# EAGLE design citizen-scientist-attachment-1 (EAGLE 9.6.2)
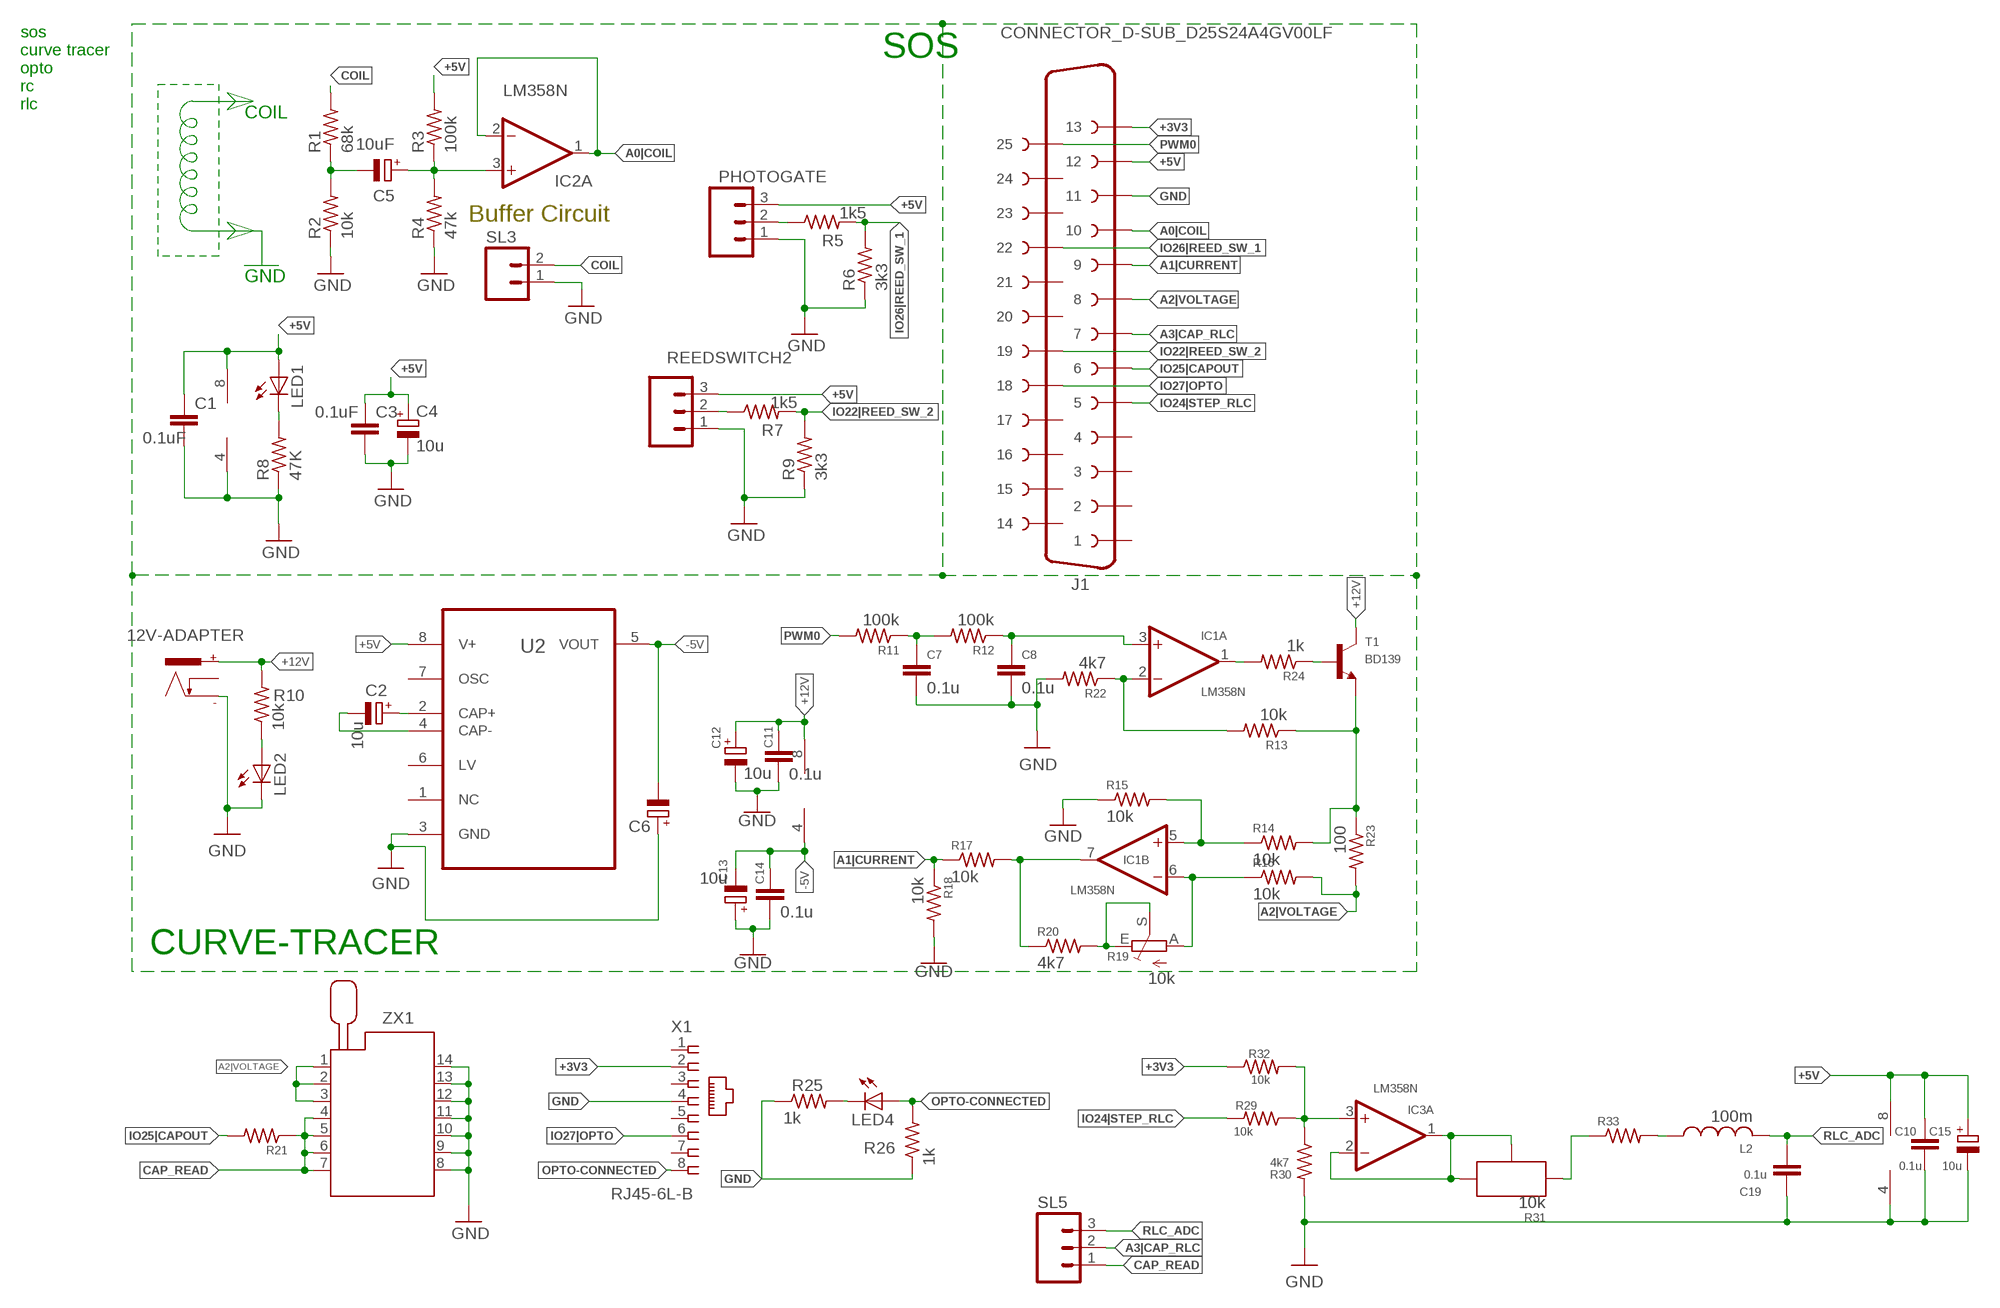
[diagram p0: schematic, sheet 1]

## Parts
12V-ADAPTER  POWER_CON  [NEB21R]
C1  0.1uF  C-EU025-025X050  [C025-025X050]
C2  10u  CPOL-EUTT2D5  [TT2D5]
C3  0.1uF  C-EU025-025X050  [C025-025X050]
C4  10u  CPOL-EUE2.5-6  [E2,5-6]
C5  10uF  CPOL-EUE2.5-6  [E2,5-6]
C6  CPOL-EUTT2D5  [TT2D5]
C7  0.1u  C-EU025-025X050  [C025-025X050]
C8  0.1u  C-EU025-025X050  [C025-025X050]
C10  0.1u  C-EU025-025X050  [C025-025X050]
C11  0.1u  C-EU025-025X050  [C025-025X050]
C12  10u  CPOL-EUTT2D5  [TT2D5]
C13  10u  CPOL-EUTT2D5  [TT2D5]
C14  0.1u  C-EU025-025X050  [C025-025X050]
C15  10u  CPOL-EUTT2D5  [TT2D5]
C19  0.1u  C-EU025-025X050  [C025-025X050]
IC1  LM358N  [DIL08]
IC2  LM358N  [DIL08]
IC3  LM358N  [DIL08]
J1  CONNECTOR_D-SUB_D25S24A4GV00LF  [CONNECTOR_D-SUB_D25S24A4GV00LF]
L2  100m  L-US6000-XXX-RC  [6000-XXXX-RC]
LED1  LED3MM  [LED3MM]
LED2  LED3MM  [LED3MM]
LED4  LED3MM  [LED3MM]
PHOTOGATE  M03  [03P]
R1  68k  R-US_0204/7  [0204/7]
R2  10k  R-US_0204/7  [0204/7]
R3  100k  R-US_0204/7  [0204/7]
R4  47k  R-US_0204/7  [0204/7]
R5  1k5  R-US_0204/7  [0204/7]
R6  3k3  R-US_0204/7  [0204/7]
R7  1k5  R-US_0204/7  [0204/7]
R8  47K  R-US_0204/7  [0204/7]
R9  3k3  R-US_0204/7  [0204/7]
R10  10k  R-US_0204/7  [0204/7]
R11  100k  R-US_0204/7  [0204/7]
R12  100k  R-US_0204/7  [0204/7]
R13  10k  R-US_0207/10  [0207/10]
R14  10k  R-US_0207/10  [0207/10]
R15  10k  R-US_0207/10  [0207/10]
R16  10k  R-US_0207/10  [0207/10]
R17  10k  R-US_0207/10  [0207/10]
R18  10k  R-US_0207/10  [0207/10]
R19  10k  TRIM_EU-RJ9W  [RJ9W]
R20  4k7  R-US_0204/7  [0204/7]
R21  R-US_0204/7  [0204/7]
R22  4k7  R-US_0207/10  [0207/10]
R23  100  R-US_0207/10  [0207/10]
R24  1k  R-US_0204/7  [0204/7]
R25  1k  R-US_0204/7  [0204/7]
R26  1k  R-US_0204/7  [0204/7]
R29  10k  R-US_0204/7  [0204/7]
R30  4k7  R-US_0207/10  [0207/10]
R31  10k  POTNORMAL  [RJ9W]
R32  10k  R-US_0207/10  [0207/10]
R33  R-US_0204/7  [0204/7]
REEDSWITCH2  M03  [03P]
SL3  M02  [02P]
SL5  M03  [03P]
T1  BD139  [TO126]
U2  ICL7660CPAZ_ICL7660CPAZ  [ICL7660CPAZ_DIP254P762X533-8]
X1  RJ45-6L-B  [RJ45-NO-SHIELD]
ZX1  214-3339-00-0602J  [214-3339-00-0602J]

## Nets
+3V3: J1.P$13 R32.1 X1.2
+5V: C1.1 C3.1 C4.+ C10.1 C15.+ IC2.8(P:V+) IC3.8(P:V+) J1.P$14 LED1.A PHOTOGATE.3 R3.2 REEDSWITCH2.3 U2.8(V+)
+12V: 12V-ADAPTER.+ C11.1 C12.+ IC1.8(P:V+) R10.2 T1.2(C)
-5V: C6.- C13.- C14.1 IC1.4(P:V-) U2.5(VOUT)
A0|COIL: IC2.1(A:OUT) IC2.2(A:-IN) J1.P$16
A1|CURRENT: J1.P$17 R17.1 R18.1
A2|VOLTAGE: J1.P$18 R16.2 R23.2 ZX1.1 ZX1.2 ZX1.3
A3|CAP_RLC: J1.P$19 SL5.2
CAP_READ: R21.1 SL5.1 ZX1.4 ZX1.5 ZX1.6 ZX1.7
CLAMP_SIGNAL: C5.+ IC2.3(A:+IN) R3.1 R4.2
COIL: R1.2 SL3.2
GND: 12V-ADAPTER.- C1.2 C3.2 C4.- C6.+ C7.2 C8.2 C10.2 C11.2 C12.- C13.+ C14.2 C15.- C19.2 IC2.4(P:V-) IC3.4(P:V-) J1.P$15 LED2.K(C) PHOTOGATE.1 R2.1 R4.1 R6.1 R8.1 R9.1 R15.1 R18.2 R22.2 R25.1 R26.1 R30.2 REEDSWITCH2.1 SL3.1 U2.3(GND) X1.4 ZX1.8 ZX1.9 ZX1.10 ZX1.11 ZX1.12 ZX1.13 ZX1.14
IO22|REED_SW_2: J1.P$7 R7.2 R9.2
IO24|STEP_RLC: J1.P$21 R29.2
IO25|CAPOUT: J1.P$20 R21.2
IO26|REED_SW_1: J1.P$4 R5.2 R6.2
IO27|OPTO: J1.P$8 X1.6
N$1: C5.- R1.1 R2.2
N$2: PHOTOGATE.2 R5.1
N$3: R7.1 REEDSWITCH2.2
N$5: LED1.K(C) R8.2
N$9: C2.+ U2.2(CAP+)
N$10: C2.- U2.4(CAP-)
N$11: C7.1 R11.1 R12.2
N$12: LED2.A R10.1
N$13: IC1.1(A:OUT) R24.2
N$14: R24.1 T1.3(B)
N$15: C8.1 IC1.3(A:+IN) R12.1
N$16: IC1.2(A:-IN) R13.2 R22.1
N$17: IC1.5(B:+IN) R14.1 R15.2
N$18: IC1.6(B:-IN) R16.1 R19.A
N$19: R13.1 R14.2 R23.1 T1.1(E)
N$20: R19.E R19.S R20.2
N$21: IC1.7(B:OUT) R17.2 R20.1
N$22: LED4.K(C) R25.2
N$26: IC3.3(A:+IN) R29.1 R30.1 R32.2
N$27: IC3.1(A:OUT) IC3.2(A:-IN) R31.A R31.S
N$28: R31.E R33.1
N$29: L2.1 R33.2
OPTO-CONNECTED: LED4.A R26.2 X1.8
PWM0: J1.P$1 R11.2
PWM1: J1.P$6
RLC_ADC: C19.1 L2.2 SL5.3
Unconnected: 12V-ADAPTER.C IC2.5(B:+IN) IC2.6(B:-IN) IC2.7(B:OUT) IC3.5(B:+IN) IC3.6(B:-IN) IC3.7(B:OUT) J1.1 J1.P$2 J1.P$3 J1.P$5 J1.P$9 J1.P$10 J1.P$11 J1.P$12 J1.P$22 J1.P$23 J1.P$24 U2.1(NC) U2.6(LV) U2.7(OSC) X1.1 X1.3 X1.5 X1.7

## Notes on the sheet
- SOS
- sos
  curve tracer
  opto
  rc
  rlc
- COIL
- Buffer Circuit
- GND
- CURVE-TRACER

## Library data of the parts
12V-ADAPTER = CEDT_JANUARY_2015_v5:POWER_CON: DC Power Connector
C1 C3 = Arduino_Hackathon_v5:C-EU: CAPACITOR, European symbol
C2 C4-C6 C12 C13 C15 = rcl:CPOL-EU: POLARIZED CAPACITOR, European symbol; SPICEPREFIX: C
C7 C8 C10 C11 C14 C19 = rcl:C-EU: CAPACITOR, European symbol; SPICEPREFIX: C
IC1-IC3 = CEDT_JANUARY_2015_v5:LM358: OP AMP also LM158; LM258; LM2904 Source: http://cache.national.com/ds/LM/LM158.pdf
J1 = d25-female:CONNECTOR_D-SUB_D25S24A4GV00LF: D-SUB, 25POS, RCPT, VERT SLDR Datasheet <https://cdn.amphenol-icc.com/media/wysiwyg/files/documentation/datasheet/inputoutput/io_dsub_d8656.pdf> Drawing <https://cdn.amphenol-icc.com/media/wysiwyg/files/drawing/c01-8646-0815.pdf>; CATEGORY: Connector; DESCRIPTION: 25 Position D-Sub Receptacle, Female Sockets Connector; GENDER: Female; MANUFACTURER: amphenol-icc; MPN: D25S24A4GV00LF; OPERATING_TEMP: -55°C to +125°C; PART_STATUS: Active; ROHS_COMPLIANT: EU RoHS With Exemption 6c; SERIES: DELTA D; SUB-CATEGORY: D-SUB; TYPE: Vertical
L2 = rcl:L-US: INDUCTOR, American symbol; SPICEPREFIX: L
LED1 LED2 LED4 = CEDT_JANUARY_2015_v5:LED
PHOTOGATE REEDSWITCH2 SL5 = con-amp-quick:M03: AMP QUICK CONNECTOR; OC_FARNELL: unknown; OC_NEWARK: unknown
R1-R18 R20-R26 R29 R30 R32 R33 = rcl:R-US_: RESISTOR, American symbol; SPICEPREFIX: R
R19 = pot:TRIM_EU-: POTENTIOMETER
R31 = CEDT_JANUARY_2015_v5:POT
SL3 = con-amp-quick:M02: AMP QUICK CONNECTOR; OC_FARNELL: unknown; OC_NEWARK: unknown
T1 = transistor:BD139: NPN TRANSISTOR
U2 = CurveTracer_V6:ICL7660CPAZ_ICL7660CPAZ: CMOS Voltage Converters Check prices <https://pricing.snapeda.com/parts/ICL7660CPAZ/Renesas%20Electronics/view-part?ref=eda>; AVAILABILITY: In Stock; DESCRIPTION: Charge Pump Switching Regulator IC Positive or Negative Fixed -Vin, 2Vin 1 Output 45mA 8-DIP (0.300, 7.62mm); MF: Renesas Electronics; MP: ICL7660CPAZ; PACKAGE: DIP-8 Intersil; PRICE: None
X1 = con-tycoelectronics:RJ45: CORCOM Modular RJ Jacks No Shield Source: www.tycoelectronics.com .. ENG_DS_1654001_1099_RJ_L_0507.pdf; MPN: RJ45-6L-B; OC_FARNELL: unknown; OC_NEWARK: 16R6090
ZX1 = con-3m:214-3339-00-0602J: Zero Insertion Force Socked Source: http://www.3M.com/ehpd; MF: 3M; MPN: 214-3339-00-0602J; OC_FARNELL: 1247151; OC_NEWARK: 85K7793

## Net classes
0 default: width 0.813 mm
1 POWER: width 1.016 mm

## Board
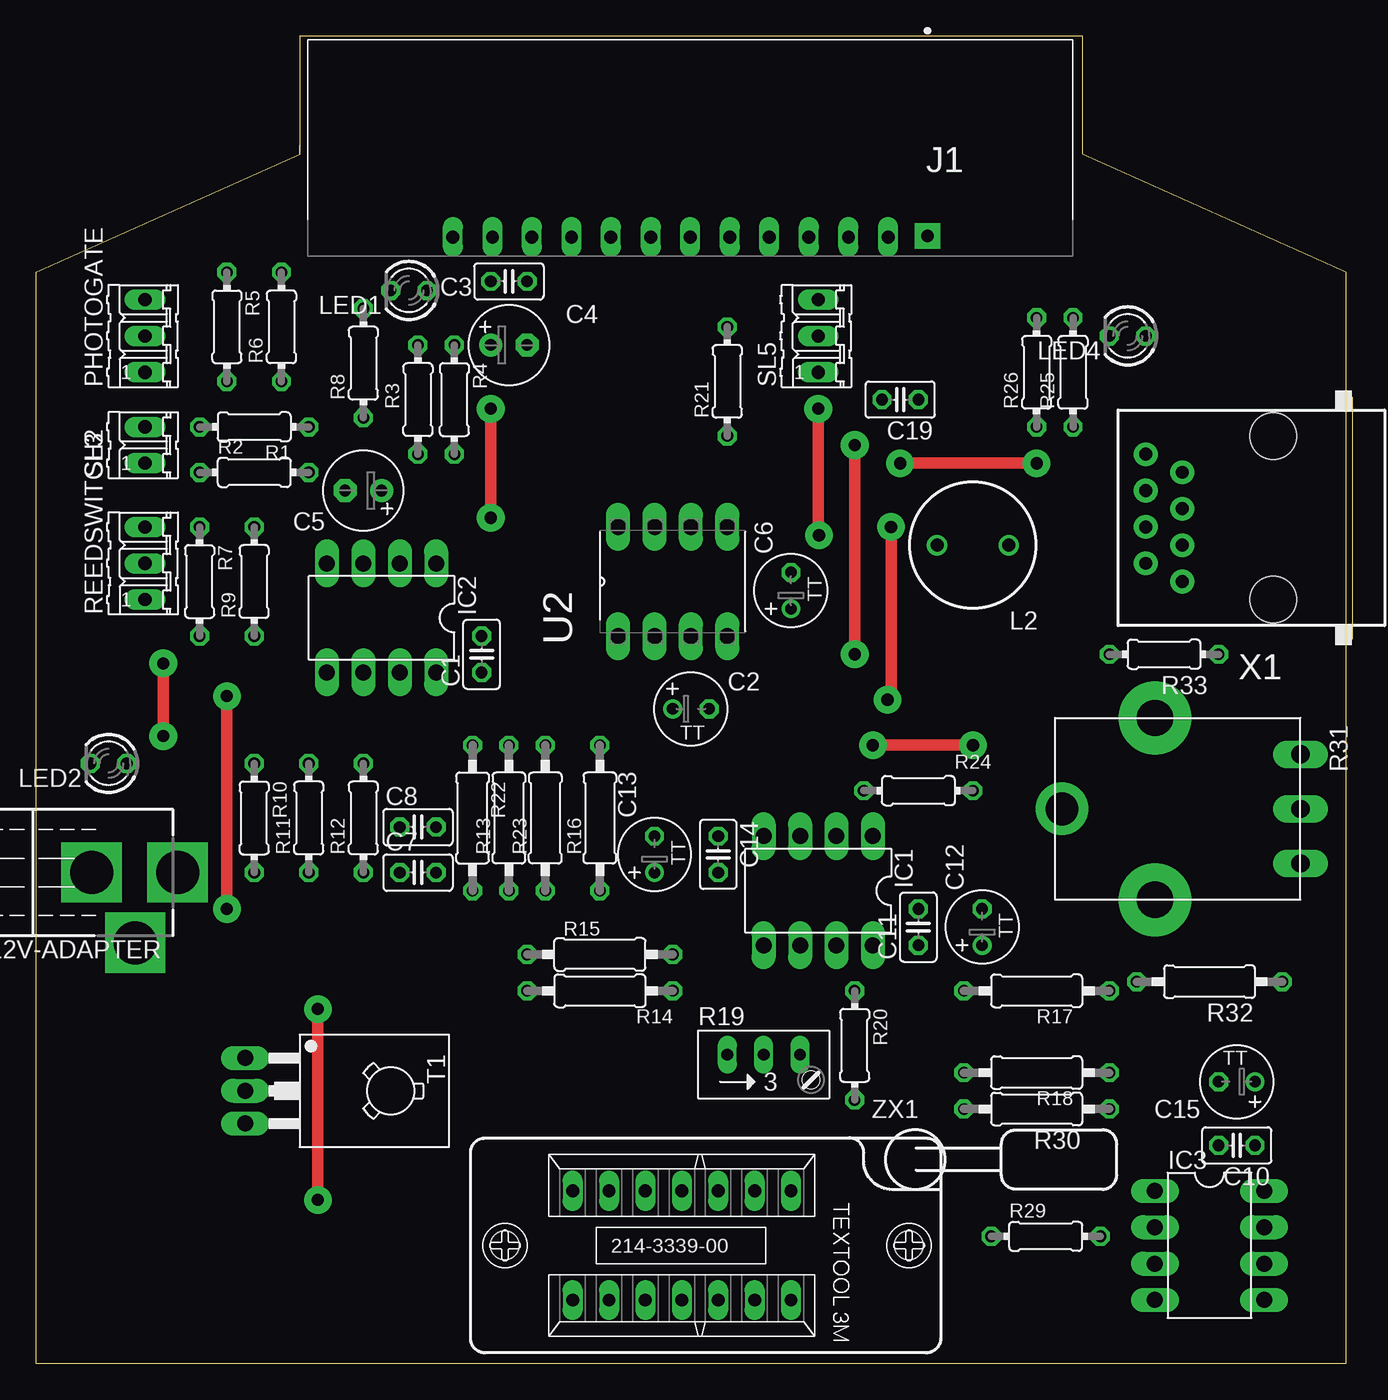
[diagram p1: board, top side]
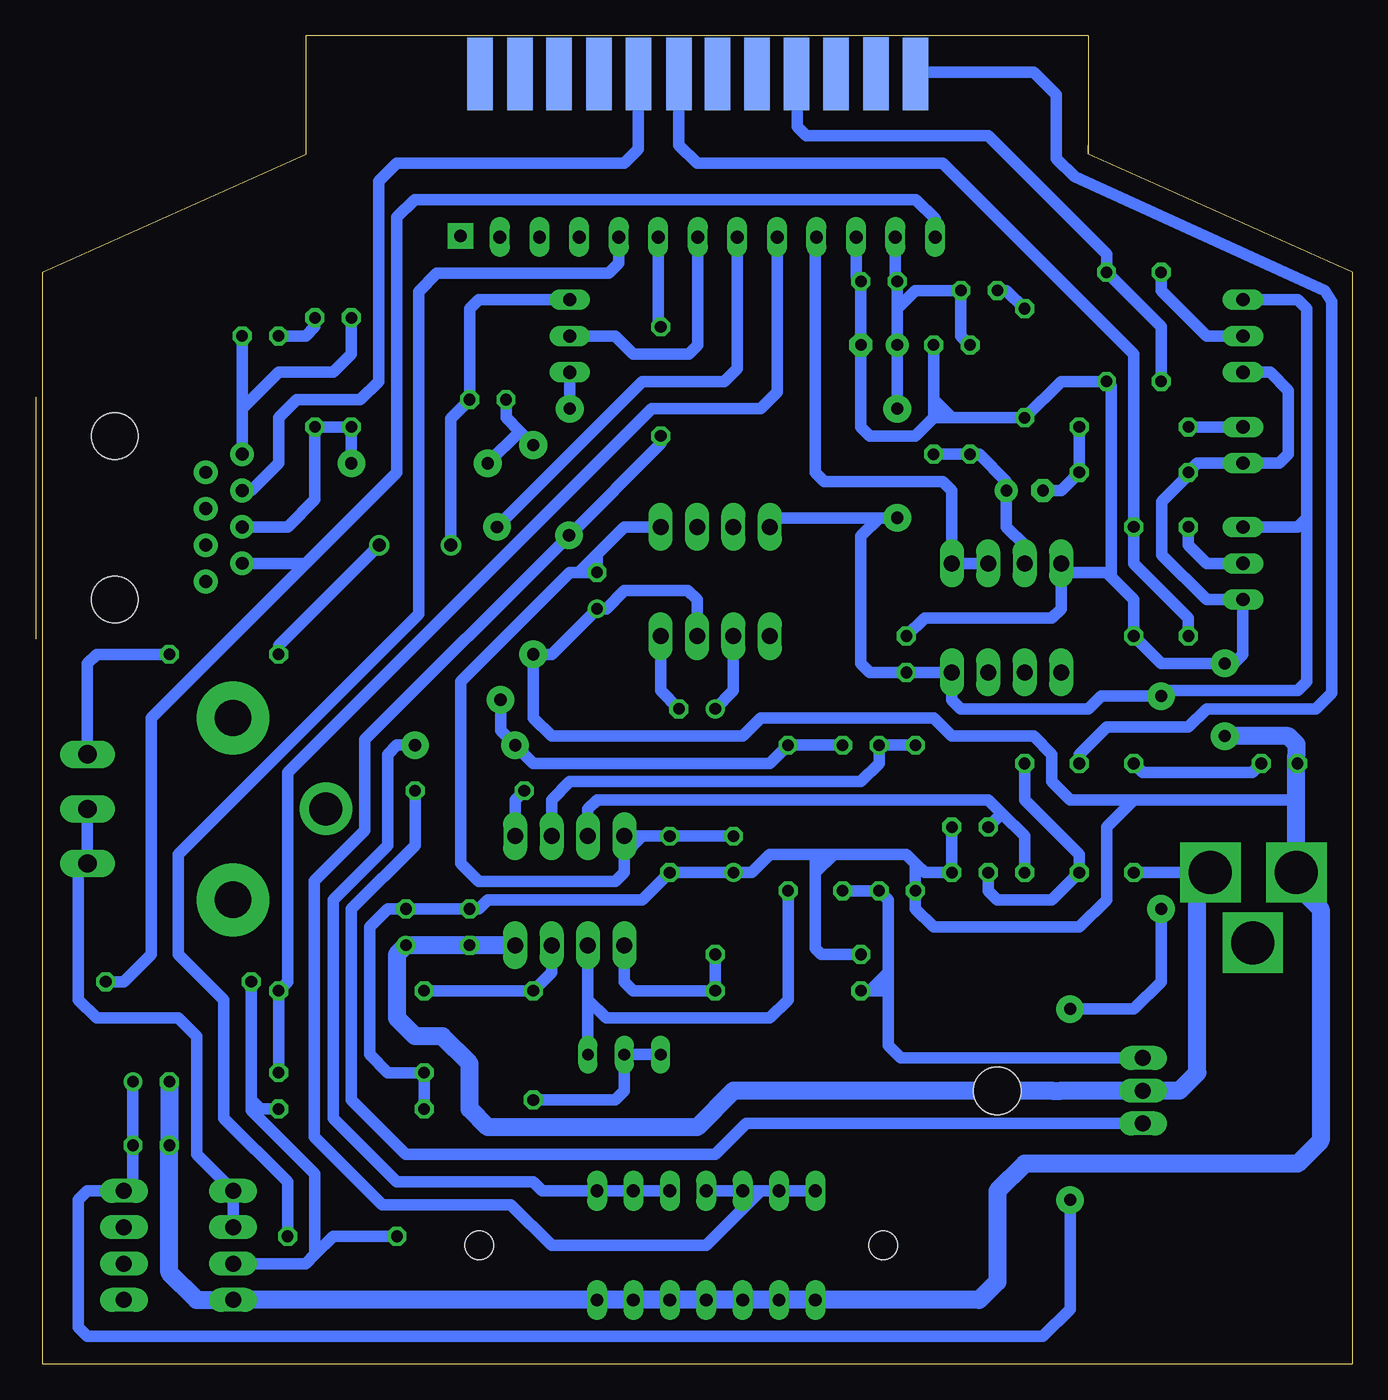
[diagram p2: board, bottom side, seen from below]

Size 91.87 x 92.71 mm. Coordinates in mm from the lower left corner, seen from the top.
Outline: 18.43,92.71 18.41,84.45
Outline: 18.41,92.71 73.03,92.71 73.03,84.45 91.44,76.2 91.44,0 0,0 0,76.2 18.41,84.45
Outline: 18.41,84.45 18.41,85.09
Copper layers (1*16): Top 0.035mm / dielectric 1.5mm / Bottom 0.035mm
Design rules "default *": minimum track width 6mil, minimum drill 0.35mm, track to track 12mil, track to pad 12mil, pad to pad 12mil, via to via 12mil, smd to smd 12mil, copper to edge 40mil, drill to drill 6mil, minimum pad ring 10mil, minimum via ring 8mil, stop-mask expansion 4mil, vias tented up to drill 0mil, thermal gap 10mil

### Footprints (pad centres in the part's own frame; a part is rotated, then mirrored left to right if it is on the bottom)
NEB21R = drill 3 pad 4.2 square: + 0,3.54; - 0,-2.46; C 4.9,0.59
C025-025X050 = drill 0.813 octagon: 1 -1.27,0; 2 1.27,0
TT2D5 = drill 0.813: + -1.27,0 | drill 0.813 octagon: - 1.27,0
E2,5-6 = drill 0.813 pad 1.6: + -1.27,0 | drill 0.813 pad 1.6 octagon: - 1.27,0
DIL08 = drill 1.118 long: 1 -3.81,-3.81; 2 -1.27,-3.81; 3 1.27,-3.81; 4 3.81,-3.81; 5 3.81,3.81; 6 1.27,3.81; 7 -1.27,3.81; 8 -3.81,3.81
CONNECTOR_D-SUB_D25S24A4GV00LF = drill 0.9 pad 1.778 square: 1 0,-8.89 | smd 1.778 x 5.08 bottom: P$1 -31.75,2.413; P$2 -28.981,2.438; P$3 -26.213,2.413; P$4 -23.444,2.413; P$5 -20.701,2.413; P$6 -17.932,2.413; P$7 -15.24,2.413; P$8 -12.421,2.413; P$9 -9.652,2.413; P$10 -6.883,2.413; P$11 -4.14,2.413; P$12 -1.372,2.413 | drill 0.899 long: P$13 -33.122,-8.966; P$14 -30.353,-8.966; P$15 -27.61,-8.966; P$16 -24.841,-8.966; P$17 -22.098,-8.966; P$18 -19.304,-8.966; P$19 -16.561,-8.966; P$20 -13.792,-8.966; P$21 -11.049,-8.966; P$22 -8.28,-8.966; P$23 -5.512,-8.966; P$24 -2.743,-8.966
6000-XXXX-RC = drill 0.9 pad 1.422: 1 -2.5,0; 2 2.5,0
LED3MM = drill 0.813 octagon: A -1.27,0; K 1.27,0
03P = drill 0.914 long: 1 -2.54,0; 2 0,0; 3 2.54,0
0204/7 = drill 0.813 octagon: 1 -3.81,0; 2 3.81,0
0207/10 = drill 0.813 octagon: 1 -5.08,0; 2 5.08,0
RJ9W = drill 0.813 long: A 2.54,0.635; E -2.54,0.635; S 0,0.635
RJ9W' = drill 1.27 long: A 3.81,8.255; E -3.81,8.255; S 0,8.255 | drill 2.286 pad 3.658: P$1 0,-8.382 | drill 2.54 pad 5.08: P$3 6.35,-1.905; P$4 -6.35,-1.905
02P = drill 0.914 long: 1 -1.27,0; 2 1.27,0
TO126 = drill 1.118 long: 1 -2.286,-5.08; 2 0,-5.08; 3 2.286,-5.08 | hole 3.302: 0,5.08
ICL7660CPAZ_DIP254P762X533-8 = drill 1.118 long: 1 -7.62,7.62; 2 -7.62,5.08; 3 -7.62,2.54; 4 -7.62,0; 5 0,0; 6 0,2.54; 7 0,5.08; 8 0,7.62
RJ45-NO-SHIELD = drill 0.9 pad 1.651: 1 -4.445,6.35; 2 -3.175,8.89; 3 -1.905,6.35; 4 -0.635,8.89; 5 0.635,6.35; 6 1.905,8.89; 7 3.175,6.35; 8 4.445,8.89 | hole 3.251: -5.715,0; 5.715,0
214-3339-00-0602J = drill 0.9 long: 1 -7.62,-3.81; 2 -5.08,-3.81; 3 -2.54,-3.81; 4 0,-3.81; 5 2.54,-3.81; 6 5.08,-3.81; 7 7.62,-3.81; 8 7.62,3.81; 9 5.08,3.81; 10 2.54,3.81; 11 0,3.81; 12 -2.54,3.81; 13 -5.08,3.81; 14 -7.62,3.81 | hole 2: 12.35,0; -15.85,0

### Placement (x,y rotation side)
12V-ADAPTER  6.35,34.29 270 top
C1  31.11,49.53 90 top
C2  45.72,45.72 0 top
C3  33.02,75.56 0 top
C4  33.02,71.12 0 top
C5  22.86,60.96 180 top
C6  52.7,53.98 90 top
C7  26.67,34.29 0 top
C8  26.67,37.47 0 top
C10  83.82,15.24 180 top
C11  61.59,30.48 90 top
C12  66.04,30.48 90 top
C13  43.18,35.56 90 top
C14  47.62,35.56 270 top
C15  83.82,19.68 180 top
C19  60.33,67.31 180 top
IC1  54.61,33.02 180 top
IC2  24.13,52.07 180 top
IC3  81.92,8.26 270 top
J1  62.23,87.63 0 top
L2  65.41,57.15 180 top
LED1  26.04,74.93 180 top
LED2  5.08,41.91 180 top
LED4  76.2,71.75 180 top
PHOTOGATE  7.62,71.75 90 top
R1  15.24,65.41 180 top
R2  15.24,62.23 0 top
R3  26.67,67.31 90 top
R4  29.21,67.31 270 top
R5  13.34,72.39 270 top
R6  17.14,72.39 90 top
R7  11.43,54.61 270 top
R8  22.86,69.85 90 top
R9  15.24,54.61 90 top
R10  15.24,38.1 270 top
R11  19.05,38.1 90 top
R12  22.86,38.1 90 top
R13  33.02,38.1 90 top
R14  39.37,26.04 180 top
R15  39.37,28.57 0 top
R16  39.37,38.1 90 top
R17  69.85,26.04 180 top
R18  69.85,20.32 180 top
R19  50.8,20.95 0 top
R20  57.15,22.23 270 top
R21  48.26,68.58 90 top
R22  30.48,38.1 270 top
R23  35.56,38.1 90 top
R24  61.59,40.01 180 top
R25  72.39,69.22 90 top
R26  69.85,69.22 90 top
R29  70.48,8.89 0 top
R30  69.85,17.78 180 top
R31  10k  [RJ9W']  80.01,38.73 270 top
R32  81.92,26.67 180 top
R33  78.74,49.53 180 top
REEDSWITCH2  7.62,55.88 90 top
SL3  7.62,64.14 90 top
SL5  54.61,71.75 90 top
T1  19.68,19.05 270 top
U2  48.26,58.42 90 top
X1  86.36,59.05 90 top
ZX1  45.09,8.26 180 top

### Tracks (layer width: path | path; a pad name or v marks a point on that pad's centre or on a via)
+3V3
  Bottom 0.813: J1.P$13 29.11,79.93 30.45,81.28 65.43,81.28 66.67,80.04 66.67,62.23 73.03,55.88 | 73.03,55.88 X1.2 | 73.03,55.88 83.82,45.09 83.82,28.57 85.72,26.67 R32.1
+5V  (via drill 0.85 pad 1.93)
  Top 0.813: v31.75,66.67 v31.75,59.05 | v13.34,46.61 v13.34,31.75 | v19.68,24.77 v19.68,11.43
  Bottom 0.813: J1.P$14 31.88,75.69 C3.1 31.75,73.66 | 31.75,73.66 C4.+ v31.75,66.67 | PHOTOGATE.3 3.81,74.3 3.17,73.66 3.17,59.05 | 3.17,59.05 3.81,58.42 REEDSWITCH2.3 | 31.75,73.66 30.48,74.93 LED1.A 27.3,71.75 R3.2 | 3.17,59.05 3.17,47.62 3.81,46.99 12.95,46.99 v13.34,46.61 17.53,46.61 18.41,45.72 27.3,45.72 27.94,46.35 IC2.8 C1.1 33.66,48.26 34.29,48.9 34.29,57.78 33.02,59.05 v31.75,59.05 40.01,59.05 U2.8 | C15.+ C10.1 85.09,12.7 IC3.8 88.27,12.06 88.9,11.43 88.9,2.54 88.27,1.91 21.59,1.91 19.68,3.81 v19.68,11.43 | v13.34,31.75 13.34,26.67 15.24,24.77 v19.68,24.77
+12V
  Bottom 0.813: R10.2 12V-ADAPTER.+ | 12.06,19.05 T1.2 15.24,19.05 17.78,19.05 | 20.32,19.05 20.95,19.05
  Bottom 1.27: 12V-ADAPTER.+ 10.79,33.38 10.79,20.32 12.06,19.05 15.24,19.05 | T1.2 17.78,19.05 20.32,19.05 20.95,19.05 24.13,19.05 43.18,19.05 45.72,16.51 60.33,16.51 61.59,17.78 61.59,20.95 63.5,22.86 65.41,22.86 66.67,24.13 66.67,28.57 C12.+ C11.1 IC1.8
-5V
  Bottom 0.813: 52.7,56.52 C6.- 53.98,55.24 | U2.5 50.8,58.42 52.7,56.52 | C13.- C14.1 49.53,36.83 | 49.53,36.83 IC1.4 | 49.53,36.83 50.8,35.56 50.8,34.29 51.44,33.66 60.96,33.66 62.23,34.92 62.23,47.62 54.61,55.24 53.98,55.24 | 52.7,56.52 53.98,55.24
A0|COIL
  Bottom 0.813: IC2.2 IC2.1 27.94,60.96 28.57,61.59 36.83,61.59 37.47,62.23 37.47,78.59 J1.P$16
A1|CURRENT
  Bottom 0.813: R18.1 R17.1 74.3,26.67 74.3,41.27 48.9,66.67 41.27,66.67 40.13,67.82 J1.P$17
A2|VOLTAGE  (via drill 0.85 pad 1.93)
  Top 0.813: v65.41,43.18 v58.42,43.18 | v59.69,58.42 59.69,46.61 v59.44,46.35
  Bottom 0.813: R23.2 R16.2 40.64,41.91 57.15,41.91 v58.42,43.18 59.44,44.2 v59.44,46.35 | ZX1.3 ZX1.2 ZX1.1 56.52,12.06 57.15,12.7 66.67,12.7 71.12,17.14 71.12,32.38 67.31,36.2 67.31,42.55 66.67,43.18 v65.41,43.18 | J1.P$18 42.93,69.47 43.81,68.58 49.53,68.58 v59.69,58.42
A3|CAP_RLC
  Bottom 0.813: SL5.2 51.44,71.75 50.16,70.48 46.3,70.48 45.67,71.12 J1.P$19
CAP_READ  (via drill 0.85 pad 1.93)
  Top 0.813: v54.61,66.67 54.61,57.88 v54.66,57.83
  Bottom 0.813: R21.1 48.26,64.23 v54.66,57.83 68.91,43.58 68.91,37.23 72.44,33.7 72.44,15.83 67.71,11.1 58.73,11.1 55.88,8.26 45.09,8.26 41.91,11.43 | 41.91,11.43 ZX1.5 | ZX1.7 ZX1.6 41.27,12.06 | ZX1.5 ZX1.4 | SL5.1 v54.61,66.67 | ZX1.5 41.27,12.06 | 41.91,11.43 41.27,12.06
CLAMP_SIGNAL
  Bottom 0.813: R4.2 R3.1 26.04,63.5 24.13,61.59 C5.+ 24.13,58.42 22.86,57.15 IC2.3
COIL
  Bottom 0.813: R1.2 SL3.2
GND  (via drill 0.85 pad 1.93)
  Top 0.813: v57.15,64.14 v57.15,49.53 | v8.89,48.9 v8.89,43.81 | v69.85,62.87 v60.33,62.87
  Bottom 0.813: J1.P$15 34.62,75.89 C3.2 C4.- 34.29,65.41 33.66,64.77 30.48,64.77 29.21,66.04 | 27.94,66.04 R8.1 20.32,68.58 R6.1 16.83,68.26 16.83,54.93 | 27.94,66.04 29.21,66.04 | R4.1 29.21,67.31 | 29.21,67.31 29.21,66.04 | 16.83,54.93 17.14,55.24 19.68,55.24 IC2.4 20.32,52.7 20.95,52.07 29.84,52.07 C1.2 | 16.83,54.93 15.24,53.34 R9.1 13.34,48.9 v8.89,48.9 8.26,48.9 7.62,49.53 REEDSWITCH2.1 10.16,53.34 13.28,56.46 13.28,60.2 11.43,62.05 R2.1 10.79,62.87 SL3.1 5.08,62.87 4.45,63.5 4.45,67.94 5.71,69.22 PHOTOGATE.1 | X1.4 74.3,58.42 72.39,60.33 R25.1 R26.1 v69.85,62.87 | LED2.K 3.89,41.83 3.89,39.37 15.24,39.37 | U2.3 45.72,53.34 46.35,53.98 50.8,53.98 52.07,52.7 C6.+ 55.88,49.53 v57.15,49.53 57.15,45.09 55.88,43.81 42.55,43.81 41.27,45.09 29.21,45.09 27.94,43.81 22.23,43.81 20.95,42.55 20.95,40.64 19.68,39.37 15.24,39.37 | 15.24,39.37 17.14,37.47 17.14,32.38 19.05,30.48 29.21,30.48 30.48,31.75 R22.2 30.48,34.92 | C8.2 C7.2 29.84,34.29 30.48,34.92 | 30.48,34.92 31.11,35.56 36.2,35.56 | 36.2,35.56 37.47,35.56 | 37.47,35.56 40.64,35.56 41.91,34.29 C13.+ C14.2 49.53,32.38 60.33,32.38 60.96,31.75 C11.2 C12.- 67.31,31.75 68.58,30.48 68.58,21.59 67.31,20.32 R18.2 R30.2 | R15.1 37.04,28.57 37.47,29 37.47,34.29 | ZX1.8 ZX1.9 ZX1.10 ZX1.11 ZX1.12 ZX1.13 ZX1.14 | 78.74,4.45 IC3.4 | C19.2 59.05,66.04 58.1,65.09 | 58.1,65.09 v57.15,64.14 | v60.33,62.87 58.1,65.09 | 37.47,35.56 37.47,34.29 | 29.21,67.31 27.94,66.04 | 37.47,34.29 36.2,35.56
  Bottom 1.27: IC3.4 ZX1.14 26.04,4.45 24.77,5.71 24.77,12.06 22.86,13.97 3.81,13.97 2.21,15.57 2.21,31.75 3.89,33.43 12V-ADAPTER.- 3.89,41.83 3.89,42.55 3.89,43.26 4.45,43.81 v8.89,43.81 | 78.74,4.45 80.64,4.45 82.55,6.35 C10.2 C15.-
IO22|REED_SW_2
  Bottom 0.813: R7.2 11.43,52.07 15.24,55.88 R9.2 15.24,70.48 28.57,83.82 45.72,83.82 46.99,85.09 J1.P$7
IO24|STEP_RLC
  Bottom 0.813: J1.P$21 51.18,76.83 51.89,76.12 63.88,76.12 65.15,74.85 65.15,52.32 81.92,35.56 81.92,28.57 78.74,25.4 78.74,17.14 74.3,12.7 R29.2
IO25|CAPOUT
  Bottom 0.813: J1.P$20 48.44,72.57 R21.2
IO26|REED_SW_1
  Bottom 0.813: R5.2 13.34,72.39 R6.2 17.14,77.47 25.4,85.72 38.1,85.72 38.73,86.36 38.73,90.09 J1.P$4
IO27|OPTO
  Bottom 0.813: J1.P$8 49.81,84.81 50.8,83.82 66.67,83.82 67.94,82.55 67.94,68.58 69.22,67.31 73.66,67.31 74.93,66.04 74.93,62.87 76.83,60.96 X1.6
N$1
  Bottom 0.813: R1.1 R2.2 20.32,60.96 C5.-
N$2
  Bottom 0.813: PHOTOGATE.2 10.16,71.75 13.34,74.93 R5.1
N$3
  Bottom 0.813: R7.1 11.43,57.15 10.16,55.88 REEDSWITCH2.2
N$5
  Bottom 0.813: LED1.K 24.13,74.93 R8.2
N$9
  Bottom 0.813: C2.+ 43.18,46.99 U2.2
N$10
  Bottom 0.813: C2.- 48.26,46.99 U2.4
N$11
  Bottom 0.813: R12.2 22.86,39.37 19.05,35.56 R11.1 20.95,32.38 24.77,32.38 25.4,33.02 C7.1
N$12
  Bottom 0.813: R10.1 14.61,41.27 6.99,41.27 LED2.A
N$13
  Bottom 0.813: R24.2 58.42,39.37 IC1.1
N$14
  Bottom 0.813: T1.3 42.29,16.76 44.45,14.61 66.04,14.61 69.85,18.41 69.85,31.75 65.41,36.2 R24.1
N$15
  Bottom 0.813: R12.1 22.86,36.83 24.45,38.42 | 24.45,38.42 25.4,39.37 52.7,39.37 53.34,38.73 IC1.3 | C8.1 24.45,38.42
N$16
  Bottom 0.813: R22.1 R13.2 33.02,41.91 34.29,40.64 54.61,40.64 55.88,39.37 IC1.2
N$17
  Bottom 0.813: IC1.5 50.8,26.67 50.16,26.04 R14.1 R15.2
N$18
  Bottom 0.813: R16.1 39.37,25.4 40.64,24.13 52.07,24.13 53.34,25.4 | IC1.6 53.34,25.4 | 53.34,25.4 R19.A
N$19
  Bottom 0.813: 32.38,27.3 32.38,32.38 R13.1 R23.1 | 32.38,27.3 32.38,26.04 | 32.38,26.04 32.38,22.23 31.5,21.34 T1.1 | R14.2 33.66,26.04 | 33.66,26.04 32.38,26.04 | 33.66,26.04 32.38,27.3
N$20
  Bottom 0.813: R19.E R19.S 50.8,19.05 51.44,18.41 R20.2
N$21
  Bottom 0.813: IC1.7 55.88,27.3 R20.1 R17.2
N$22
  Bottom 0.813: LED4.K 73.03,71.75 72.39,72.39 R25.2
N$26
  Bottom 0.813: 72.39,7.62 72.39,13.24 76.85,17.7 76.83,17.71 76.83,18.41 | R32.2 76.83,18.41 | 76.83,18.41 76.2,17.78 R30.1 | R29.1 71.12,8.89 72.39,7.62 | 72.39,7.62 73.03,6.99 IC3.3
N$27
  Bottom 0.813: R31.S R31.A 88.9,34.29 88.9,25.4 87.63,24.13 81.92,24.13 80.64,22.86 80.64,14.61 IC3.1 IC3.2
N$28
  Bottom 0.813: R33.1 87.63,49.53 88.27,48.9 R31.E
N$29
  Bottom 0.813: R33.2 74.93,50.12 L2.1
OPTO-CONNECTED
  Bottom 0.813: LED4.A 77.47,66.67 | 77.47,66.67 X1.8 | R26.2 69.85,70.48 71.12,69.22 74.93,69.22 77.47,66.67
PWM0
  Bottom 0.813: R11.2 19.05,42.55 17.14,44.45 11.43,44.45 10.16,45.72 2.54,45.72 1.42,46.84 1.42,74.14 1.91,74.93 19.37,82.87 20.64,84.14 20.64,88.58 22.23,90.17 30.35,90.17 J1.P$1
RLC_ADC
  Bottom 0.813: SL5.3 60.96,74.3 61.59,73.66 C19.1 62.91,66 L2.2